# Altium schematic sheet indication.SchDoc
size A4; SheetNumber: 4; SheetTotal: 7
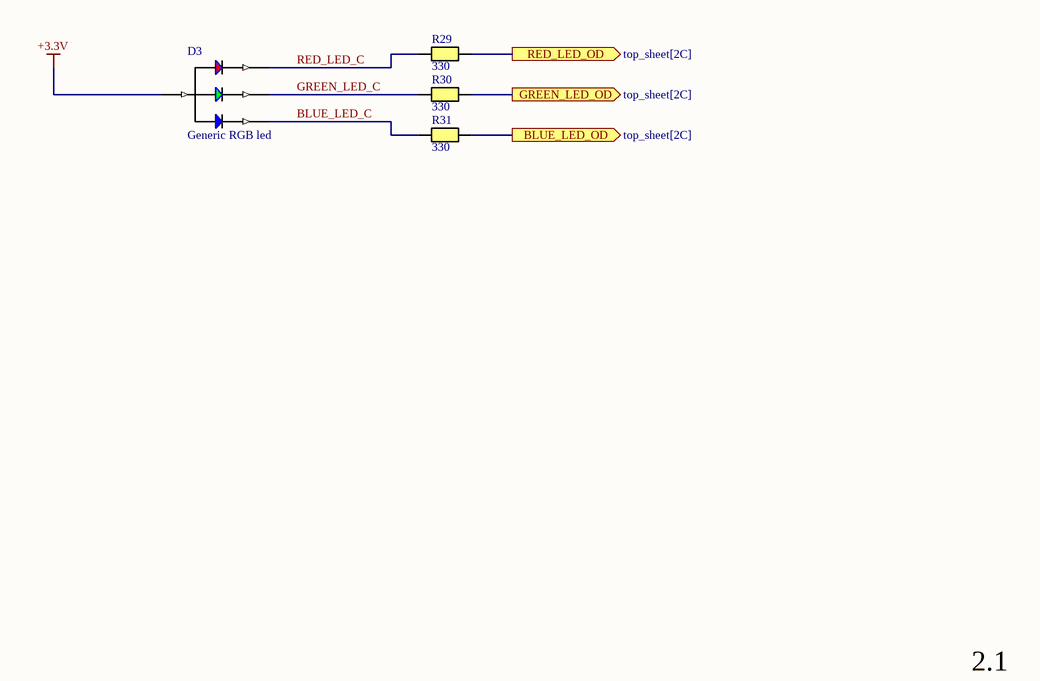
[diagram p0: indication.SchDoc]

## Parts
D3  Generic RGB led  [RGB throu hole 90 deg]
R29  330  [RESC0603(1608)_N]
R30  330  [RESC0603(1608)_N]
R31  330  [RESC0603(1608)_N]

## Ports
BLUE_LED_OD (out, see top_sheet[2C]), GREEN_LED_OD (out, see top_sheet[2C]), RED_LED_OD (out, see top_sheet[2C])

## Nets
+3.3V: D3.CA
BLUE_LED_C: D3.BC R31.1
BLUE_LED_OD: R31.2 ; port BLUE_LED_OD
GREEN_LED_C: D3.GC R30.1
GREEN_LED_OD: R30.2 ; port GREEN_LED_OD
RED_LED_C: D3.RC R29.1
RED_LED_OD: R29.2 ; port RED_LED_OD

## Notes on the sheet
- 2.1

## Library data of the parts
D3 = RGB led
R29-R31 = Resistor M: Resistor Medium Density; Value: 330